# Altium schematic sheet BPS_PowerOutput_v1-0.SchDoc
size A3
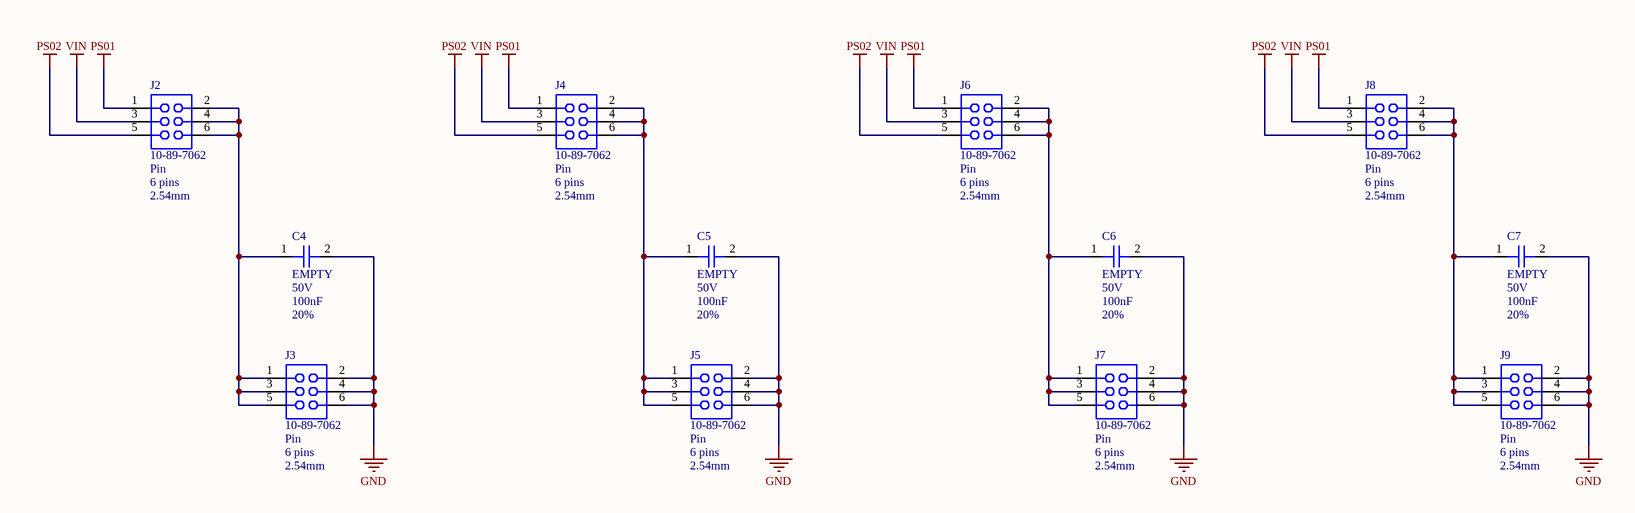
[diagram p0: BPS_PowerOutput_v1-0.SchDoc]

## Parts
C4  value 100nF  PartNumber1: EMPTY  Voltage: 50V  Tolerance: 20%  [Cap0805]  (hidden comment: WCAP-CSGP (0805))
C5  value 100nF  PartNumber1: EMPTY  Voltage: 50V  Tolerance: 20%  [Cap0805]  (hidden comment: WCAP-CSGP (0805))
C6  value 100nF  PartNumber1: EMPTY  Voltage: 50V  Tolerance: 20%  [Cap0805]  (hidden comment: WCAP-CSGP (0805))
C7  value 100nF  PartNumber1: EMPTY  Voltage: 50V  Tolerance: 20%  [Cap0805]  (hidden comment: WCAP-CSGP (0805))
J2  Type: Pin  Pins: 6 pins  Pitch: 2.54mm  [CONDIL06STRMALE_100_100]  (hidden comment: 10-89-7062)
J3  Type: Pin  Pins: 6 pins  Pitch: 2.54mm  [CONDIL06STRMALE_100_100]  (hidden comment: 10-89-7062)
J4  Type: Pin  Pins: 6 pins  Pitch: 2.54mm  [CONDIL06STRMALE_100_100]  (hidden comment: 10-89-7062)
J5  Type: Pin  Pins: 6 pins  Pitch: 2.54mm  [CONDIL06STRMALE_100_100]  (hidden comment: 10-89-7062)
J6  Type: Pin  Pins: 6 pins  Pitch: 2.54mm  [CONDIL06STRMALE_100_100]  (hidden comment: 10-89-7062)
J7  Type: Pin  Pins: 6 pins  Pitch: 2.54mm  [CONDIL06STRMALE_100_100]  (hidden comment: 10-89-7062)
J8  Type: Pin  Pins: 6 pins  Pitch: 2.54mm  [CONDIL06STRMALE_100_100]  (hidden comment: 10-89-7062)
J9  Type: Pin  Pins: 6 pins  Pitch: 2.54mm  [CONDIL06STRMALE_100_100]  (hidden comment: 10-89-7062)

## Nets
GND: C4.2 C5.2 C6.2 C7.2 J3.2 J3.4 J3.6 J5.2 J5.4 J5.6 J7.2 J7.4 J7.6 J9.2 J9.4 J9.6
PS01: J2.1 J4.1 J6.1 J8.1
PS02: J2.5 J4.5 J6.5 J8.5
VIN: J2.3 J4.3 J6.3 J8.3
NetC4_1: C4.1 J2.2 J2.4 J2.6 J3.1 J3.3 J3.5
NetC5_1: C5.1 J4.2 J4.4 J4.6 J5.1 J5.3 J5.5
NetC6_1: C6.1 J6.2 J6.4 J6.6 J7.1 J7.3 J7.5
NetC7_1: C7.1 J8.2 J8.4 J8.6 J9.1 J9.3 J9.5

## Notes on the sheet
- Title
- Author
- Checked By
- Size:
- Revision:
- A3
- Date:
- Project
- Time:
- Sheet
- of
- File:

## Library data of the parts
C4-C7 = WCAP-CSGP (0805): Surface Mount Multilayer Ceramic Chip Capacitors  for Commercial Applications; Manufacturer1: Wurth; Published: 19-Jun-2016; LatestRevisionDate: 19-Jun-2016; Publisher: Lucas Moraes; PackageReference: CAP0805; PackageDescription: CAP0805;2 Leads
J2-J9 = 10-89-7062: Headers & Wire Housings C-Grid PCB Conn SR V onn SR Vt Tn-A 8Ckt; Manufacturer1: Molex; LastRevisionNote: Created; Gender: Male; Direction: 180; Published: 12-Sep-2017; LatestRevisionDate: 12-Sep-2017; PackageReference: CONDIL6; Publisher: Douglas Alves; PackageDescription: CONDIL6; 6 Leads; PartNumber1: 10-89-7062